# Altium schematic sheet PMON.SchDoc
size A3
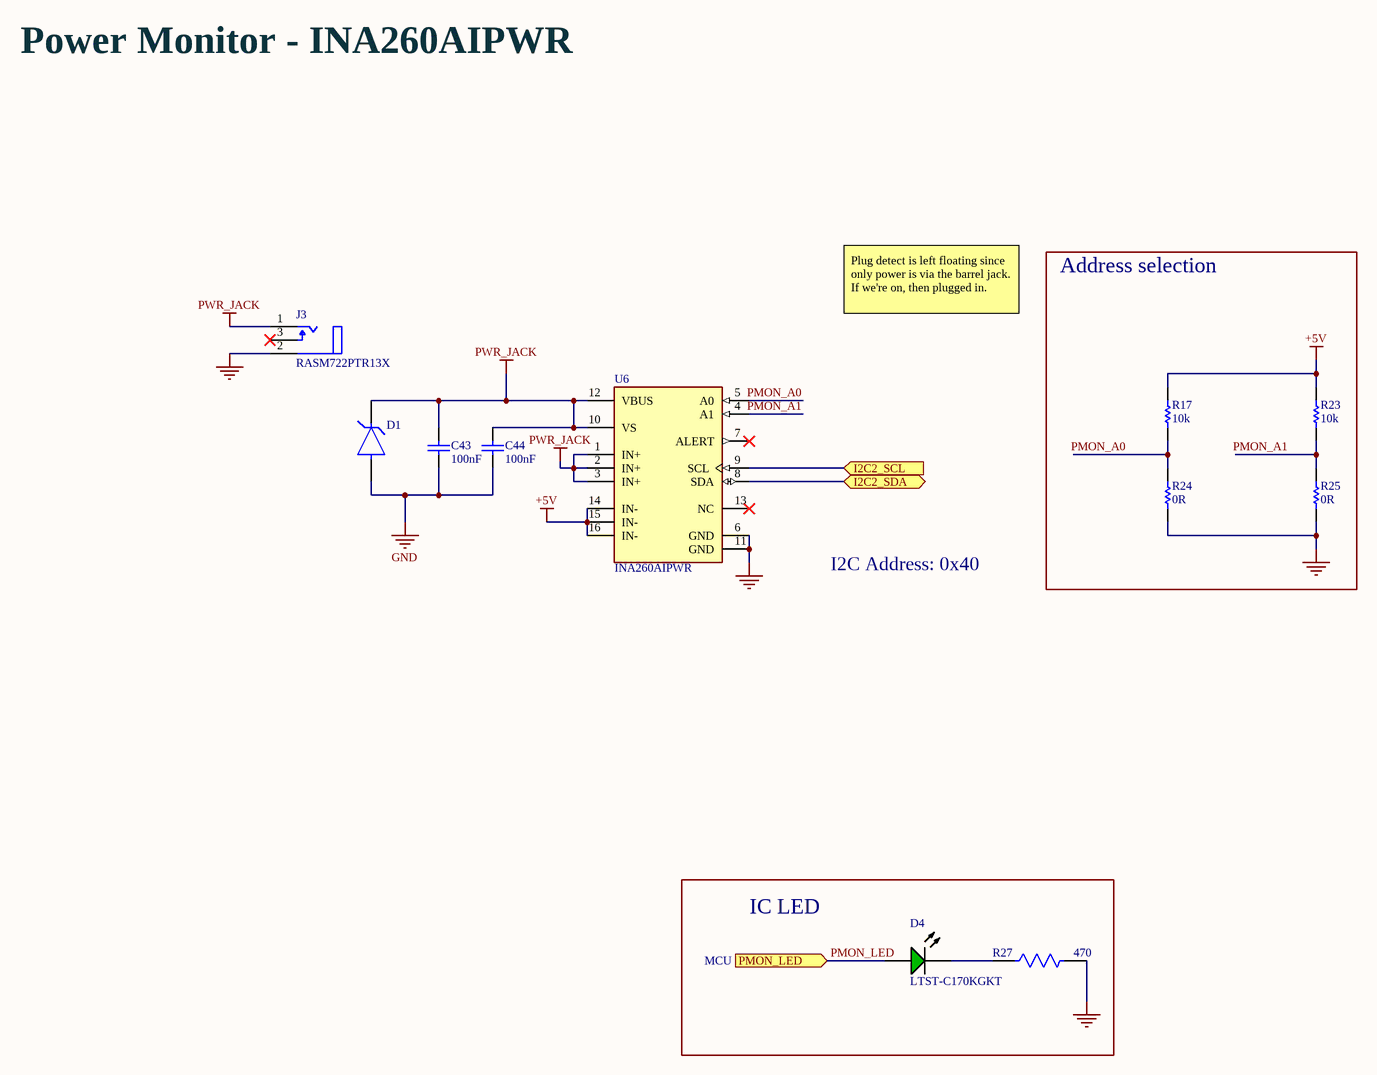
[diagram p0: PMON.SchDoc]

## Parts
C43  100nF  [CAPC1005X55X25ML05T10]
C44  100nF  [CAPC1005X55X25ML05T10]
D1  SMBJ5.0A-TR  [FP-SMB-MFG]  (value not drawn)
D4  LTST-C170KGKT  [LTST-LTST-C170KGKT-2_V]
J3  RASM722PTR13X  [FP-RASM722PTR13X-MFG]
R17  10k  [RESC1608X55X25ML10T15]
R23  10k  [RESC1608X55X25ML10T15]
R24  0R  [RESC1608X55X25ML10T15]
R25  0R  [RESC1608X55X25ML10T15]
R27  470  [FP-CPF0603-MFG]
U6  INA260AIPWR  [FP-PW0016A-MFG]

## Blocks framed on the sheet
Address selection: R17 R23-R25
IC LED: D4 R27

## Ports
I2C2_SCL (in, see GPS, Header, MCU), I2C2_SDA (bidir, see GPS, Header, MCU), PMON_LED (in, see MCU)

## Nets
+5V: R17.2 R23.2 U6.14(IN-) U6.15(IN-) U6.16(IN-)
GND: C43.1 C44.1 D1.2(A) J3.2(SLEEVE_TERMINAL) R24.1 R25.1 R27.2 U6.6(GND) U6.11(GND)
PWR_JACK: C43.2 C44.2 D1.1(K) J3.1(TIP_TERMINAL(CENTER_PIN)) U6.1(IN+) U6.2(IN+) U6.3(IN+) U6.10(VS) U6.12(VBUS)
I2C2_SCL: U6.9(SCL) ; port I2C2_SCL
I2C2_SDA: U6.8(SDA) ; port I2C2_SDA
PMON_A0: R17.1 R24.2 U6.5(A0)
PMON_A1: R23.1 R25.2 U6.4(A1)
PMON_LED: D4.2(A) ; port PMON_LED
NetD4_1: D4.1(K) R27.1

Not connected (* = marked no-connect by the designer): J3 3(SHUNT_TERMINAL)*; U6 7(ALERT)* 13(NC)*

## Notes on the sheet
- Power Monitor - INA260AIPWR
- Plug detect is left floating since only power is via the barrel jack. If we're on, then plugged in.
- I2C Address: 0x40

## Library data of the parts
C43 C44 = CMP-2008-04536-1: GRM155R60J104KA01D; Manufacturer: Murata; Part Number: GRM155R60J104KA01D
D1 = CMP-12225-000019-1: TVS DIODE 5V 13.4V SMB; Manufacturer: STMicroelectronics; Number Of Channels: 1; Peak Pulse Power: 600W; Clamping Voltage: 14.4V; Standoff Height: 0.05mm; Peak Pulse Current: 275A; Max Junction Temp: +150°C; Direction: Unidirectional; Breakdown Voltage: 6.4V; Device Class L3: unset; Mouser Description: SMBJ Series 600 W 5 V Uni Directional SMT TVS Diode - DO-214AA; Automotive: No; Lead Free: Yes; ComponentLink2URL: https://www.st.com/resource/en/datasheet/smbj.pdf; Package: SMB; Reverse Standoff Voltage: 5V; Device Class L1: Circuit Protection; RoHS: TRUE; Temperature Range Low: -55°C; Category: Diode; Manufacturer Part Number: SMBJ5.0A-TR; Digikey Description: TVS DIODE 5V 13.4V SMB; Height: 2.65mm; Temperature Range High: +150°C; Octopart: https://octopart.com/smbj5.0a-tr-stmicroelectronics-347079; Device Class L2: TVS Diodes; ComponentLink2Description: Datasheet; Temperature: -55°C to +150°C
D4 = CMP-2000-06620-1: Ultra Bright AlInGaP Chip LED, 75 mW, -55 to 85 degC, 2-Pin SMD (0805), RoHS, Tape and Reel; Manufacturer: Lite-On; Forward Current: 30mA; Power Dissipation Max: 75mW; Emitting Color: YellowGreen; Type: Uni-Color; Forward Voltage: 2.4V; Dominant Wave Length: 571nm; Test Current (It): 20mA; Product Length (mm): 2mm; Peak Wavelength: 574nm; Power Dissipation: 75W; Product Depth (mm): 1.25mm; DELETED: Compliant; High Brightness: Yes; Product Height (mm): 1.1mm; Luminous Intensity: 35mcd; Shape Type: Rectangular; Chip Material: AlGaInP; Viewing Angle: 130deg; Number of  Elements: 1; Reverse Voltage: 5V; Rad Hardened: No; Package Type: ChipLed; Manufacturer URL: http://www.us.liteon.com/; Mounting: SurfaceMount; Operating Temp Range: -55Cto85C; Datasheet URL: http://optoelectronics.liteon.com/upload/download/DS22-2000-073/S_110_LTST-C170KGKT.pdf; Packaging: TapeandReel; Pin Count: 2; Package Description: 2-Pin Surface Mounted Device, Body 2 x 1.25 mm; Mounting Technology: SurfaceMount; Package Reference: LTST-C170KGKT-2; Forward Current Max: 30mA; Datasheet Version: Rev. G, 06/2005; Lens Dimensions: 1.4x1.25x0.6mm; Operating Temperature Classification: Industrial; Lum Intensity: 35mcd; Main Category: ChipLED
J3 = CMP-47995-000002-1: CONN PWR JACK 2.1X5.5MM SOLDER; Shielding: Unshielded; Gender: Male; Current Rating: 5A; Termination: Solder; Contact Material: Copper Alloy; Package Quantity: 120; Case/Package: SMD/SMT; Contact Plating: Tin; Connector Type: Jack; Housing Material: Thermoplastic; Mount: Surface Mount; Housing Color: Black; Color: Black
R17 R23 = CMP-2000-05022-1: Resistor, 10 KOhm, +/- 5%, 100 mW, -55 to 155 degC, 0603 (1608 Metric), RoHS, Tape and Reel; Manufacturer: Yageo; Resistance: 10kOhms; Voltage Rating: 50V; Temperature Coefficient: 100PPM/C; Power Rating: 100mW; Package Reference: 603; Series: RC; Case Code - mm: 1608; Packaging: Reel; Datasheet URL: http://www.farnell.com/datasheets/443971.pdf; Datasheet Version: Rev. 4, 04/2009; Operating Temperature Range: -55Cto+155C; Product: ThickFilmResistorsGeneralPurpose; Package Description: 2-Pin Surface Mount Device, Body 1.6 x 0.8 mm; Manufacturer URL: http://www.yageo.com/; Case Code - in: 0603; Tolerance: 5%; Termination Style: SMD/SMT
R24 R25 = CMP-2100-03667-1: Chip Resistor, 0 Ohm, +/- 5%, 0.1 W, -55 to 155 degC, 0603 (1608 Metric), RoHS, Tape and Reel; Manufacturer: Yageo; Temperature Coefficient: 200ppm/degreesC; Voltage Rating: 50V; Power Rating: 100mW; Resistance: 0mOhm; Width: 0.8mm; Max Operating Temperature: 155degC; Tolerance: 5%; Package Reference: 0603; Height: 0.45mm; Depth: 0.8mm; Package Description: 2-Pin Surface Mount Device, Body 1.6 x 0.8 mm; Termination: SMD/SMT; Package Quantity: 5000; Case/Package: 0603; Case Code (Imperial): 0603; Radiation Hardening: No; Number of Pins: 2; Length: 1.6mm; Lead Free: LeadFree; Voltage Rating (DC): 50V; Military Standard: Not; Datasheet URL: http://www.yageo.com/NewPortal/yageodocoutput?fileName=/pdf/R-Chip/PYu-RC_Group_51_RoHS_L_5.pdf; Manufacturer URL: http://www.yageo.com/; Packaging: TapeandReel; Case Code (Metric): 1608; Min Operating Temperature: -55degC; Composition: ThickFilm; RoHSCompliant: true; Contact Plating: Tin; Datasheet Version: Rev. 5, 10/2016; REACH SVHC: NoSVHC
R27 = CMP-03211-004765-1: RES SMD 470Ω 0.1% 1/16W 0603 / CPF0603B470RE; Manufacturer: TE Connectivity; Temperature Coefficient: 25ppm/°C; Voltage Rating: 50V; Power Rating: 0.063W; Value: 470Ω; Device Class L3: Chip SMD Resistors; RoHS: TRUE; Category: Res; Device Class L2: Resistors; Series: CPF; Height: 0.55mm; Temperature: -55°C to +155°C; Temperature Range High: +155°C; Automotive: No; octopart_url: https://octopart.com/cpf0603b470re-te+connectivity-23376607; packaging: 5k Reel; ComponentLink2Description: Datasheet; Temperature Range Low: -55°C; Device Class L1: Passive Components; Ipc Land Pattern Name: RESC15580X45; Package: CPF0603; Composition: Thin Film; Manufacturer Part Number: CPF0603B470RE; Resistance: 470Ω; Octopart: https://octopart.com/cpf0603b470re-te+connectivity-23376607; Lead Free: Yes; ComponentLink2URL: https://www.te.com/commerce/DocumentDelivery/DDEController?Action=showdoc&DocId=Data+Sheet%7F1773200%7FM%7Fpdf%7FEnglish%7FENG_DS_1773200_M.pdf%7F3-1676481-2; Tolerance: 0.1%
U6 = CMP-04910-000015-1: IC MONITOR PWR/CURR 16TSSOP; Manufacturer: Texas Instruments; Nominal Supply Current: 310uA; Max Junction Temp: +150°C; Standoff Height: 0.05mm; Max Supply Voltage: 5.5V; Min Supply Voltage: 2.7V; Output Current: 10mA; Ambient Temperature Range High: +125°C; ComponentLink2Description: Datasheet; Manufacturer Part Number: INA260AIPWR; Automotive: No; RoHS: TRUE; Lead Free: Yes; Package: PW0016A; Device Class L2: Power Management ICs; Temperature Range Low: -40°C; Digikey Description: IC MONITOR PWR/CURR 16TSSOP; Height: 1.2mm; Temperature: -40°C to +125°C; Device Class L1: Integrated Circuits (ICs); Device Class L3: unset; Octopart: https://octopart.com/ina260aipwr-texas+instruments-75199489; Category: IC; Ambient Temperature Range Low: -40°C; Temperature Range High: +125°C; ComponentLink2URL: http://www.ti.com/lit/ds/symlink/ina260.pdf